# EasyEDA Pro project MOTORDRIVERTEST.eprj

# Schematic Schematic1
Board Name: Board1; Create Date: 2025-09-04; Page Name: P1; Project Name: MOTORDRIVERTEST; Schematic Name: Schematic1; Update Date: 2025-09-04; Company: EasyEDA.com; Page Size: A4; Version: V1.0
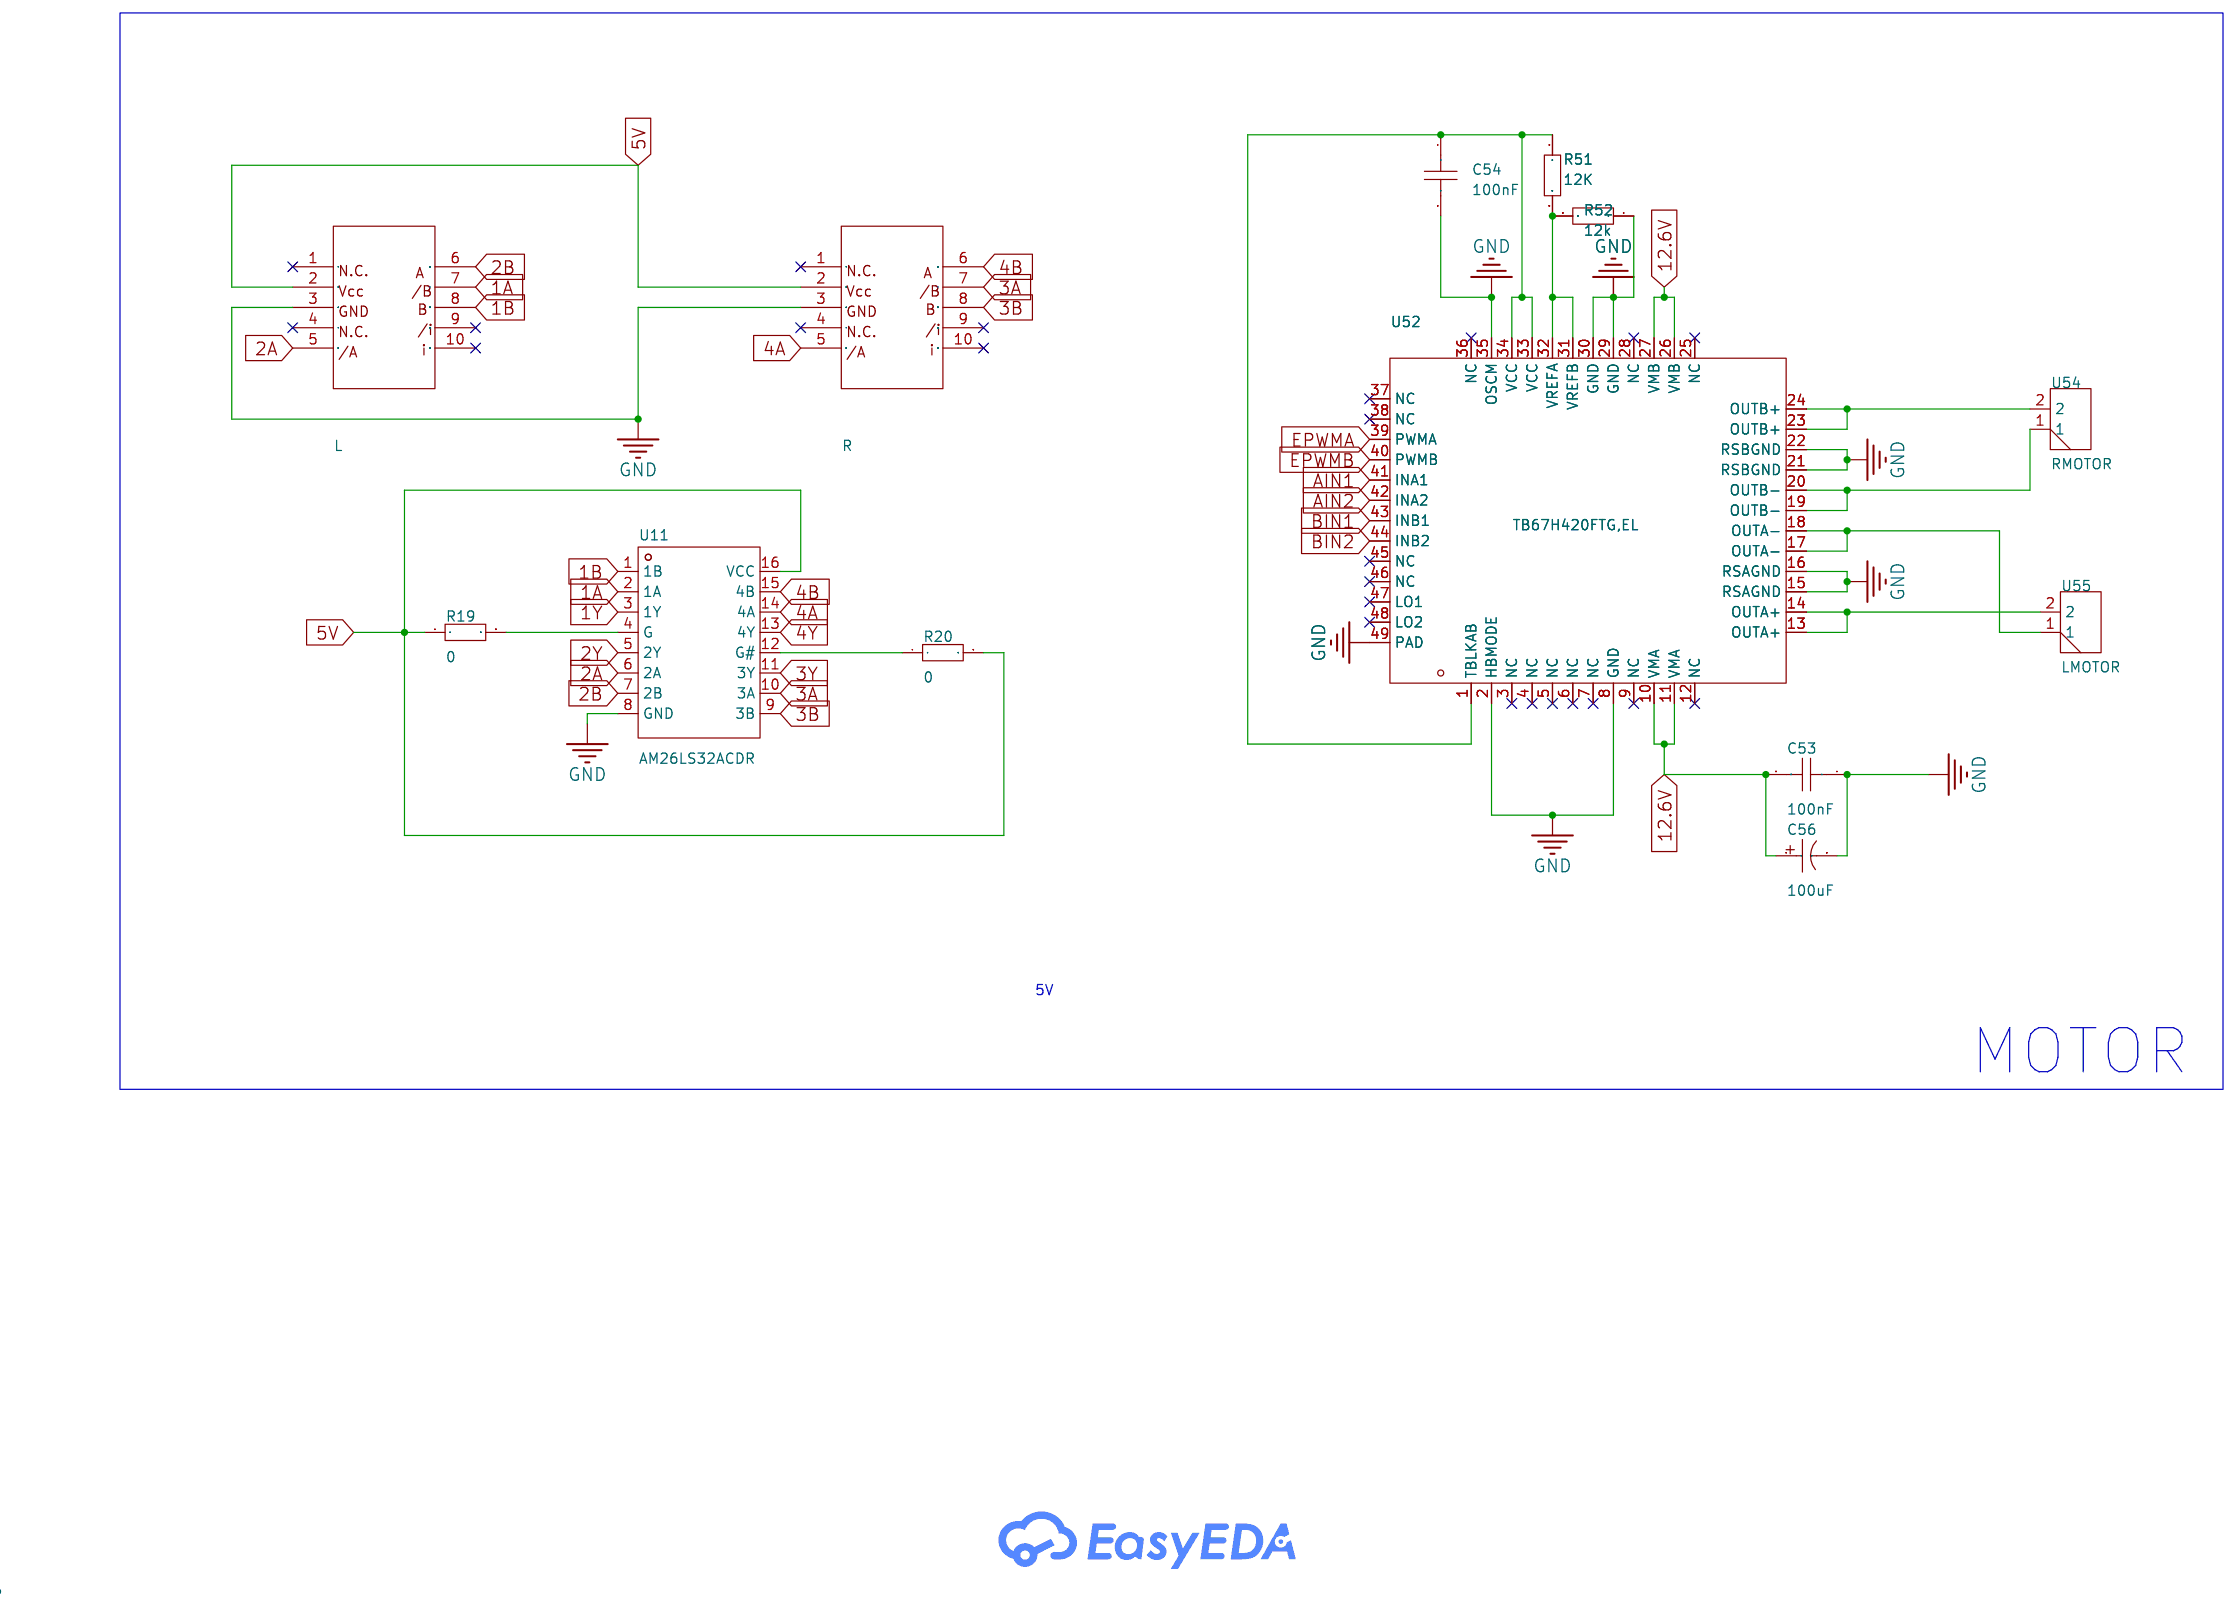
[diagram p0: schematic sheet]

## Parts
C53  100nF  [C0603]
C54  100nF  [C0603]
C56  100uF  [CAP-SMD_BD6.3-L6.6-W6.6-FD]
R19  0  [R0603]
R20  0  [R0603]
R51  12K  [R0603]
R52  12k  [R0603]
U11  AM26LS32ACDR  [SOIC-16_L9.9-W3.9-P1.27-LS6.0-BL]
U50  L  [Encoder]
U51  R  [Encoder]
U52  TB67H420FTG,EL  [QFN-48_L7.0-W7.0-P0.50-BL-EP5.4]
U54  RMOTOR  [5267_2P]
U55  LMOTOR  [5267_2P]

## Library data of the parts
C53 C54 = CAP_0603: Supplier Footprint: 0603
C56 = RT1C101M0605: Capacitance:100uF Tolerance:±20% Tolerance:±20% Voltage Rating:16V Ripple Current:58mA@120Hz Equivalent Series Resistance(ESR):- Diameter:6.3mm Height - Seated (Max):5.4mm Lifetime:2000hrs@125℃ Operating Temperature:-40℃~+105℃ Operating Temperature:-40℃~+; LCSC Part Name: 100uF ±20% 16V; Supplier Part: C267461; Manufacturer: ROQANG(容强); Supplier Footprint: SMD,D6.3xL5.4mm; JLCPCB Part Class: Extended Part; Datasheet: https://atta.szlcsc.com/upload/public/pdf/source/20180813/C267472_55C74989F74FEE2EA57202A0C1074BEF.pdf; Supplier: LCSC; Tolerance: ±20%; Voltage Rating: 16V; Ripple Current: 58mA@120Hz; Diameter: 6.3mm; Height - Seated (Max): 5.4mm; Lifetime: 2000hrs@125℃; Operating Temperature: -40℃~+105℃
R19 R20 R51 R52 = Res_0603: Supplier Footprint: 0603
U11 = AM26LS32ACDR: Type:Receivers Number of Drivers:0 Number of Receivers:4 Voltage - Supply:4.75V~5.25V Voltage - Supply:4.75V~5.25V Operating Temperature:0℃~+70℃ Operating Temperature:0℃~+70℃; LCSC Part Name: 四路差分线接收器; Supplier Part: C6180; Manufacturer: TI(德州仪器); Supplier Footprint: SOIC-16; JLCPCB Part Class: Extended Part; Datasheet: https://www.ti.com/cn/lit/gpn/am26ls32ac; Supplier: LCSC; Type: Receivers; Number of Drivers: 0; Number of Receivers: 4; Voltage - Supply: 4.75V~5.25V; Operating Temperature: 0℃~+70℃
U50 U51 = Encoder
U52 = TB67H420FTG,EL: LCSC Part Name: 9A 有刷直流电机驱动芯片 5.5V; Supplier Part: C2150535; Manufacturer: TOSHIBA(东芝); Supplier Footprint: QFN-48-EP(7x7); JLCPCB Part Class: Extended Part; Datasheet: https://atta.szlcsc.com/upload/public/pdf/source/20210718/C2150535_772875BEA68F83793892421782555318.pdf; Supplier: LCSC
U54 U55 = Molex_5267_2P

## Nets
5V: R19.1 R20.2 U11.16(VCC) U50.2 U51.2
12.6V: C53.2 C56.1 U52.10(VMA) U52.11(VMA) U52.26(VMB) U52.27(VMB)
GND: C53.1 C54.2 C56.2 R52.1 U11.8(GND) U50.3 U51.3 U52.2(HBMODE) U52.8(GND) U52.15(RSAGND) U52.16(RSAGND) U52.21(RSBGND) U52.22(RSBGND) U52.29(GND) U52.30(GND) U52.35(OSCM) U52.49(PAD)
1A: U11.2(1A) U50.7
1B: U11.1(1B) U50.8
1Y: U11.3(1Y)
2A: U11.6(2A) U50.5
2B: U11.7(2B) U50.6
2Y: U11.5(2Y)
3A: U11.10(3A) U51.7
3B: U11.9(3B) U51.8
3Y: U11.11(3Y)
4A: U11.14(4A) U51.5
4B: U11.15(4B) U51.6
4Y: U11.13(4Y)
AIN1: U52.41(INA1)
AIN2: U52.42(INA2)
BIN1: U52.43(INB1)
BIN2: U52.44(INB2)
EPWMA: U52.39(PWMA)
EPWMB: U52.40(PWMB)
Net-(C54-1): C54.1 R51.1 U52.1(TBLKAB) U52.33(VCC) U52.34(VCC)
Net-(R19-2): R19.2 U11.4(G)
Net-(R20-1): R20.1 U11.12(G#)
Net-(R51-2): R51.2 R52.2 U52.31(VREFB) U52.32(VREFA)
Net-(U52-13): U52.13(OUTA+) U52.14(OUTA+) U55.2
Net-(U52-17): U52.17(OUTA-) U52.18(OUTA-) U55.1
Net-(U52-19): U52.19(OUTB-) U52.20(OUTB-) U54.1
Net-(U52-23): U52.23(OUTB+) U52.24(OUTB+) U54.2

Not connected (* = marked no-connect by the designer): U50 1* 4* 9* 10*; U51 1* 4* 9* 10*; U52 3(NC)* 4(NC)* 5(NC)* 6(NC)* 7(NC)* 9(NC)* 12(NC)* 25(NC)* 28(NC)* 36(NC)* 37(NC)* 38(NC)* 45(NC)* 46(NC)* 47(LO1)* 48(LO2)*

## Notes on the sheet
- 다이오드 가능성 확인하기
  특수핀들 다시한번 확인하기
  5V전류확인
- MOTOR

# Board PCB1
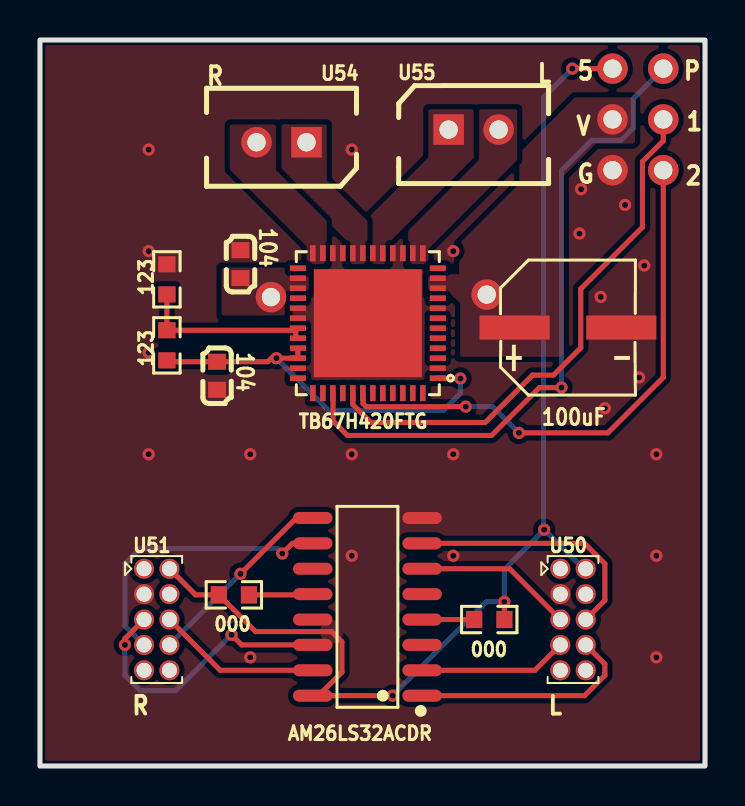
[diagram p1: board, top side]
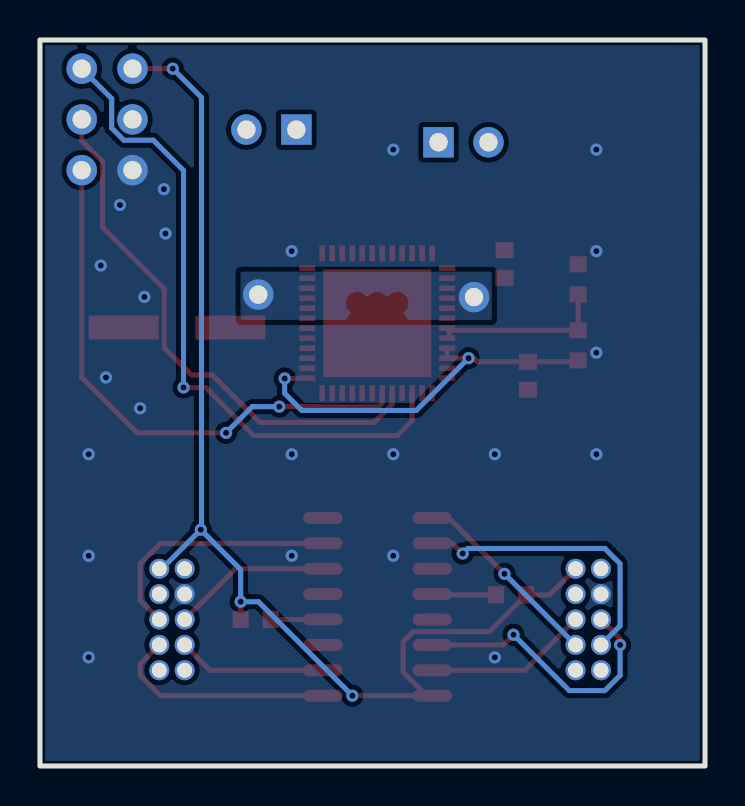
[diagram p2: board, bottom side, seen from below]

Outline 33.27 x 36.32 mm; copper layers: Top Layer, Bottom Layer. Coordinates in mm from the lower left corner of the outline.
Outline path: rectangle 0,36.32 33.27,0
Stack: Top Layer 0.035mm / Dielectric1 1.51mm FR4 er 4.5 / Bottom Layer 0.035mm

## Design rules (mm)
template: Custom Config
spacing copperThickness1oz (default): track to track 0.102, other pairs 0.152 to 0.3
spacing copperThickness2oz: track to track 0.203, other pairs 0.152 to 0.3
track width copperThickness1oz (default): min 0.127, default 0.254, max 2.54
track width copperThickness2oz: min 0.203, default 0.254, max 2.54
differential pair differentialPair (default): width min 0.127, default 0.254, max 2.54; gap min 0.152, default 0.152
via viaSize (default): diameter min 0.5, default 0.61, max 10; hole min 0.3, default 0.305, max 6.3

## Placement (name value [footprint] x y rotation side)
000  -  [R0603]  22.48 7.33 180 top
000#2  -  [R0603]  9.7 8.56 180 top
123  -  [R0603]  6.35 24.35 270 top
123#2  -  [R0603]  6.35 21.05 90 top
AM26LS32ACDR  AM26LS32ACDR  [SOIC-16_L9.9-W3.9-P1.27-LS6.0-BL]  16.38 7.96 90 top
C53  100nF  [C0603]  10.03 25.11 270 top
C54  100nF  [C0603]  8.86 19.53 270 top
C56  100uF  [CAP-SMD_BD6.3-L6.6-W6.6-FD]  26.42 21.93 0 top
NOREF  -  [Pad_e62]  31.19 29.81 0 top
NOREF#2  -  [Pad_e63]  28.65 34.89 0 top
NOREF#3  -  [Pad_e271]  22.35 23.59 0 top
NOREF#4  -  [Pad_e64]  28.65 32.35 0 top
NOREF#5  -  [Pad_e280]  11.56 23.46 0 top
NOREF#6  -  [Pad_e60]  31.19 34.89 0 top
NOREF#7  -  [Pad_e65]  28.65 29.81 0 top
NOREF#8  -  [Pad_e61]  31.19 32.35 0 top
TB67H420FTG  TB67H420FTG,EL  [QFN-48_L7.0-W7.0-P0.50-BL-EP5.4]  16.4 22.15 90 top
U50  L  [Encoder]  26.67 7.33 0 top
U51  R  [Encoder]  5.84 7.33 0 top
U54  RMOTOR  [5267_2P]  13.34 31.2 180 top
U55  LMOTOR  [5267_2P]  20.45 31.84 0 top

## Footprints (pads in the part's own frame, mm; a bottom-side part is the same pattern mirrored in y, then rotated)
5267_2P
  rect 1.524x1.524 hole 0.914: 1(0,0)
  round 1.524 hole 0.914: 2(2.5,0)
C0603
  rect 0.8x0.9 smd: 1(-0.7,0) 2(0.7,0)
CAP-SMD_BD6.3-L6.6-W6.6-FD
  rect 3.5x1.2 smd: 1(-2.67,0) 2(2.67,0)
Encoder
  round 1 hole 0.75: 1(-0.635,2.54) 2(0.635,2.54) 3(-0.635,1.27) 4(0.635,1.27) 5(-0.635,0) 6(0.635,0) 7(-0.635,-1.27) 8(0.635,-1.27) 9(-0.635,-2.54) 10(0.635,-2.54)
Pad_e60
  round 1.524 hole 0.914: 1(0,0)
Pad_e61
  round 1.524 hole 0.914: 2(0,0)
Pad_e62
  round 1.524 hole 0.914: 3(0,0)
Pad_e63
  round 1.524 hole 0.914: 4(0,0)
Pad_e64
  round 1.524 hole 0.914: 5(0,0)
Pad_e65
  round 1.524 hole 0.914: 6(0,0)
Pad_e271
  round 1.524 hole 0.914: 1(0,0)
Pad_e280
  round 1.524 hole 0.914: 1(0,0)
QFN-48_L7.0-W7.0-P0.50-BL-EP5.4
  rect 0.28x0.8 smd: 1(-2.75,-3.5) 2(-2.25,-3.5) 3(-1.75,-3.5) 4(-1.25,-3.5) 5(-0.75,-3.5) 6(-0.25,-3.5) 7(0.25,-3.5) 8(0.75,-3.5) 9(1.25,-3.5) 10(1.75,-3.5) 11(2.25,-3.5) 12(2.75,-3.5) 25(2.75,3.5) 26(2.25,3.5) 27(1.75,3.5) 28(1.25,3.5) 29(0.75,3.5) 30(0.25,3.5) 31(-0.25,3.5) 32(-0.75,3.5) 33(-1.25,3.5) 34(-1.75,3.5) 35(-2.25,3.5) 36(-2.75,3.5)
  rect 0.8x0.28 smd: 13(3.5,-2.75) 14(3.5,-2.25) 15(3.5,-1.75) 16(3.5,-1.25) 17(3.5,-0.75) 18(3.5,-0.25) 19(3.5,0.25) 20(3.5,0.75) 21(3.5,1.25) 22(3.5,1.75) 23(3.5,2.25) 24(3.5,2.75) 37(-3.5,2.75) 38(-3.5,2.25) 39(-3.5,1.75) 40(-3.5,1.25) 41(-3.5,0.75) 42(-3.5,0.25) 43(-3.5,-0.25) 44(-3.5,-0.75) 45(-3.5,-1.25) 46(-3.5,-1.75) 47(-3.5,-2.25) 48(-3.5,-2.75)
  rect 5.4x5.4 smd: 49(0,0)
R0603
  rect 0.806x0.864 smd: 1(-0.753,0) 2(0.753,0)
SOIC-16_L9.9-W3.9-P1.27-LS6.0-BL
  oval 0.602x1.971 smd: 1(-4.445,-2.736) 2(-3.175,-2.736) 3(-1.905,-2.736) 4(-0.635,-2.736) 5(0.635,-2.736) 6(1.905,-2.736) 7(3.175,-2.736) 8(4.445,-2.736) 9(4.445,2.736) 10(3.175,2.736) 11(1.905,2.736) 12(0.635,2.736) 13(-0.635,2.736) 14(-1.905,2.736) 15(-3.175,2.736) 16(-4.445,2.736)

## Nets
5V: 000.1 000#2.2 AM26LS32ACDR.16 NOREF#2.4 U50.2 U51.2
12.6V: C53.2 C56.1 NOREF#3.1 NOREF#4.5 NOREF#5.1 TB67H420FTG.10 TB67H420FTG.11 TB67H420FTG.26 TB67H420FTG.27
GND: 123.1 AM26LS32ACDR.8 C53.1 C54.2 C56.2 NOREF#7.6 TB67H420FTG.2 TB67H420FTG.8 TB67H420FTG.15 TB67H420FTG.16 TB67H420FTG.21 TB67H420FTG.22 TB67H420FTG.29 TB67H420FTG.30 TB67H420FTG.35 TB67H420FTG.49 U50.3 U51.3
1A: AM26LS32ACDR.2 U50.7
1B: AM26LS32ACDR.1 U50.8
1Y: AM26LS32ACDR.3
2A: AM26LS32ACDR.6 U50.5
2B: AM26LS32ACDR.7 U50.6
2Y: AM26LS32ACDR.5
3A: AM26LS32ACDR.10 U51.7
3B: AM26LS32ACDR.9 U51.8
3Y: AM26LS32ACDR.11
4A: AM26LS32ACDR.14 U51.5
4B: AM26LS32ACDR.15 U51.6
4Y: AM26LS32ACDR.13
AIN1: NOREF#8.2 TB67H420FTG.41
AIN2: NOREF.3 TB67H420FTG.42
BIN1: TB67H420FTG.43
BIN2: TB67H420FTG.44
EPWMA: NOREF#6.1 TB67H420FTG.39
EPWMB: TB67H420FTG.40
$1N1060: TB67H420FTG.19 TB67H420FTG.20 U54.1
$1N1061: TB67H420FTG.23 TB67H420FTG.24 U54.2
$1N1062: TB67H420FTG.17 TB67H420FTG.18 U55.1
$1N1064: 123#2.1 C54.1 TB67H420FTG.1 TB67H420FTG.33 TB67H420FTG.34
$1N1066: 123.2 123#2.2 TB67H420FTG.31 TB67H420FTG.32
$1N1069: TB67H420FTG.13 TB67H420FTG.14 U55.2
$1N1085: 000#2.1 AM26LS32ACDR.12
$1N1097: 000.2 AM26LS32ACDR.4

Pads without a net: TB67H420FTG 3 4 5 6 7 9 12 25 28 36 37 38 45 46 47 48; U50 1 4 9 10; U51 1 4 9 10

## Via types
v1: diameter 0.61, hole 0.305, Top Layer to Bottom Layer, 35 vias

## Routing (per net, layer and track width the routed paths; a pad name or vN(x,y) marks a point on that pad's centre or on a via; arc(x,y) is an arc through that point)
5V: length 58.7
  Top Layer w0.254: 6.48,9.87 7.78,8.56 000#2.2 10.79,6.72 14.6,6.72 15.1,6.22 15.1,4.69 13.93,3.52 ; NOREF#2.4 v1(26.63,34.89) ; 13.93,3.52 13.65,3.52 ; 13.93,3.52 v1(17.64,3.52) ; 000.1 v1(23.23,8.22)
  Bottom Layer w0.254: 27.31,9.87 27.18,9.87 v1(25.23,11.82) ; v1(25.23,11.82) 23.23,9.83 v1(23.23,8.22) 22.34,8.22 v1(17.64,3.52) ; v1(25.23,11.82) 25.19,11.86 25.19,33.45 v1(26.63,34.89)
GND:
  vias: v1(5.44,30.84) v1(5.44,25.76) v1(5.44,20.68) v1(5.44,15.6) v1(10.52,15.6) v1(10.52,5.44) v1(15.6,30.84) v1(15.6,15.6) v1(15.6,10.52) v1(20.68,25.76) v1(20.68,15.6) v1(20.68,10.52) v1(26.99,26.64) v1(27.07,28.86) v1(28.05,23.47) v1(28.26,17.9) v1(29.27,28.07) v1(29.97,19.44) v1(30.23,25.04) v1(30.84,15.6) v1(30.84,10.52) v1(30.84,5.44)
1A: length 7.4
  Top Layer w0.254: U50.7 24.77,4.79 AM26LS32ACDR.2
1B: length 11.5
  Top Layer w0.254: 19.12,3.52 27.25,3.52 28.26,4.53 28.26,5.1 U50.8
2A: length 8
  Top Layer w0.254: U50.5 23.5,9.87 AM26LS32ACDR.6
2B: length 12.8
  Top Layer w0.254: AM26LS32ACDR.7 27.25,11.14 28.26,10.12 28.26,8.29 U50.6
3A: length 14.5
  Top Layer w0.254: AM26LS32ACDR.10 12.63,11.14 v1(12.12,10.63)
  Bottom Layer w0.254: U51.7 4.25,7.02 4.25,10.12 5.01,10.89 11.87,10.89 v1(12.12,10.63)
3B: length 9.8
  Top Layer w0.254: AM26LS32ACDR.9 12.83,12.41 v1(10.03,9.62)
  Bottom Layer w0.254: v1(10.03,9.62) U51.8
4A: length 14.3
  Top Layer w0.254: AM26LS32ACDR.14 10.09,6.06 v1(9.58,6.57) ; v1(4.25,6.06) 4.25,6.37 U51.5
  Bottom Layer w0.254: v1(9.58,6.57) 6.79,3.77 5.01,3.77 4.25,4.53 v1(4.25,6.06)
4B: length 8.2
  Top Layer w0.254: AM26LS32ACDR.15 9.02,4.79 U51.6
AIN1: length 27
  Top Layer w0.254: TB67H420FTG.41 15.65,18.09 16.55,17.19 22.27,17.19 24.64,19.56 25.69,19.56 27.06,20.92 27.06,23.87 30.14,26.96 30.14,30.24 31.19,31.28 NOREF#8.2
AIN2: length 27.7
  Top Layer w0.254: v1(21.3,17.98) 19.41,17.98 19.41,17.97 16.33,17.97 16.16,18.14 16.16,18.57 16.15,18.58 TB67H420FTG.42 ; NOREF.3 31.19,19.44 28.41,16.67 v1(23.96,16.67)
  Bottom Layer w0.254: v1(23.96,16.67) 22.65,17.98 v1(21.3,17.98)
EPWMA: length 33
  Top Layer w0.254: TB67H420FTG.39 14.66,18.64 14.66,17.26 15.38,16.54 22.59,16.54 24.98,18.93 26.08,18.93 v1(26.09,18.94)
  Bottom Layer w0.254: NOREF#6.1 29.69,33.39 29.69,31.92 29.08,31.31 27.6,31.31 26.09,29.8 v1(26.09,18.94)
$1N1064: length 19.7
  Top Layer w0.254: TB67H420FTG.33 TB67H420FTG.34 v1(11.83,20.4) 11.58,20.4 11.4,20.23 C54.1 6.42,20.23 123#2.1 ; TB67H420FTG.1 19.92,19.39 v1(21.03,19.39)
  Bottom Layer w0.254: v1(11.83,20.4) 14.45,17.79 20.17,17.79 21.03,18.65 v1(21.03,19.39)
$1N1066: length 8.8
  Top Layer w0.254: 12.8,21.8 123#2.2 123.2 ; 12.8,21.8 12.8,21.51 TB67H420FTG.32 ; 12.8,21.8 TB67H420FTG.31
$1N1085: length 3.2
  Top Layer w0.254: 10.45,8.56 13.61,8.56 AM26LS32ACDR.12
$1N1097: length 2.6
  Top Layer w0.254: 000.2 AM26LS32ACDR.4

## Copper pours and planes (outline as drawn; the poured copper is in the pictures)
12.6V on Top Layer: 9.09,22.54 12.39,22.54 12.39,23.67 13.46,23.67 13.46,24.94 9.09,24.94
12.6V on Top Layer: 19.43,24.6 25.79,24.6 24.39,23.2 20.96,23.2 20.57,23.59 19.42,23.59 19.42,24.59
12.6V on Top Layer: 21.02,20.53 20.97,20.48 26.16,20.48 26.2,20.52 26.2,29.53 27.81,31.14 29.68,31.14 29.77,31.23 29.77,33.32 29.64,33.45 26.76,33.45 23.98,30.67 23.98,29.14 20.97,26.13 20.97,24.18 21.02,24.13
12.6V on Bottom Layer: 10.67,24.73 10.67,22.31 23.22,22.31 23.24,22.44 23.24,24.73
GND on Top Layer: -3.18,39 36.7,39 36.8,39.1 36.8,-0.38 34.84,-2.34 -3.97,-2.34 -4.55,-1.76 -4.55,37.63
GND on Bottom Layer: -1.14,37.94 34.16,37.94 34.16,-0.67 -1.14,-0.67
GND on Bottom Layer: -4.65,40.57 34.45,40.57 37.78,37.24 37.78,-0.58 36.6,-1.76 -3.17,-1.76 -3.37,-1.56 -3.37,39.29
$1N1060 on Top Layer: 12.08,32.11 12.08,29.53 15.37,26.25 15.37,25.11 16.38,25.11 16.38,27.27 14.35,29.3 14.35,32.09 12.3,32.11
$1N1061 on Top Layer: 9.53,32.09 11.81,32.09 11.81,29.81 14.35,27.27 14.35,25.11 13.34,25.11 13.34,26 9.5,29.84 9.5,32.07
$1N1062 on Top Layer: 19.43,32.86 19.43,30.44 16.38,27.39 16.38,25.11 16.51,24.98 17.27,24.98 17.4,25.11 17.4,26.12 21.7,30.42 21.7,32.83 21.67,32.86
$1N1069 on Top Layer: 21.97,32.86 21.97,30.44 18.42,26.89 18.42,25.09 19.41,25.09 19.43,25.11 19.43,25.87 23.88,30.32 23.88,32.86

## Text on the board
Top Silkscreen Layer: 100uF | 104 | R | L | V | G | 5 | P | 2 | 1
